# Altium schematic sheet Sheet_FS872.schdoc
size 197 x 98 mm
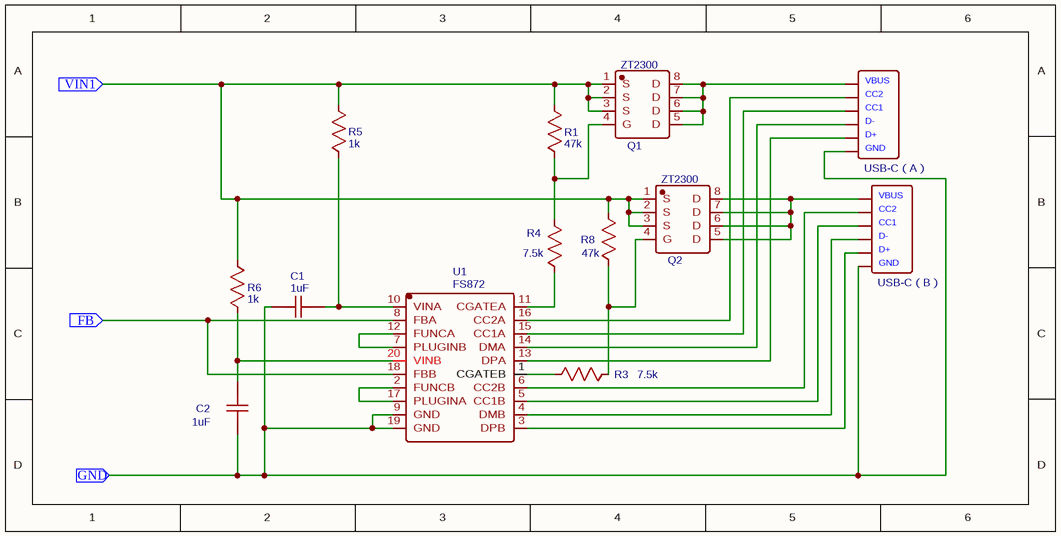
[diagram p0: Sheet_FS872.schdoc]

## Parts
C1  1uF  [C0603]
C2  1uF  [C0603]
Q1  ZT2300  [DFN3X3-8L]
Q2  ZT2300  [DFN3X3-8L]
R1  47k  [R0603]
R3  7.5k  [R0603]
R4  7.5k  [R0603]
R5  1k  [R1206]
R6  1k  [R1206]
R8  47k  [R0603]
U1  FS872  [ETSSOP20_L6.5-W4.4-P0.65-LS6.4-BL]
U2  USB-C（B）  [FCQFN-15L_L3.0-W3.0-P0.50-BL_SCT63140FMAR]
U3  USB-C（A）  [FCQFN-15L_L3.0-W3.0-P0.50-BL_SCT63140FMAR]

## Ports
FB (in), GND (in), VIN1 (in)

## Nets
FB: U1.8(FBA) U1.18(FBB) ; port FB
GND: C1.1 C2.1 U1.9(GND) U1.19(GND) ; port GND
VIN1: Q1.1(S) Q1.2(S) Q1.3(S) Q2.1(S) Q2.2(S) Q2.3(S) R1.2 R5.2 R6.2 R8.2 ; port VIN1
NetC1_2: C1.2 R5.1 U1.10(VINA)
NetC2_2: C2.2 R6.1 U1.20(VINB)
NetQ1_4: Q1.4(G) R1.1 R4.2
NetQ1_5: Q1.5(D) Q1.6(D) Q1.7(D) Q1.8(D)
NetQ2_4: Q2.4(G) R3.2 R8.1
NetQ2_5: Q2.5(D) Q2.6(D) Q2.7(D) Q2.8(D)
NetR3_1: R3.1 U1.1(CGATEB)
NetR4_1: R4.1 U1.11(CGATEA)
NetU1_2: U1.2(FUNCB) U1.17(PLUGINA)
NetU1_7: U1.7(PLUGINB) U1.12(FUNCA)

Not connected (* = marked no-connect by the designer): U1 3(DPB) 4(DMB) 5(CC1B) 6(CC2B) 13(DPA) 14(DMA) 15(CC1A) 16(CC2A); U2 2(SHELD) 3(SHELD) 4(SHELD) 5(SHELD) 6(SHELD); U3 2(SHELD) 3(SHELD) 4(SHELD) 5(SHELD) 6(SHELD)

## Notes on the sheet
- (in symbol USB-C（A）) VBUS; CC2; CC1; D-; D+; GND
- (in symbol USB-C（B）) VBUS; CC2; CC1; D-; D+; GND

## Library data of the parts
C1 C2 = 0.1u: nameAlias: Value(F); Contributor: LCEDA_Lib; Package Display: No; spicePre: C; spiceSymbolName: C_0603_US
Q1 Q2 = ZT2300: Manufacturer: VBsemi Elec; Manufacturer Part: NCE3035G; Contributor: LCSC; Supplier: LCSC; Supplier Part: C710023; spicePre: Q; spiceSymbolName: NCE3035G
R1 R8 = 47k: nameAlias: Value(Ω); Contributor: LCEDA_Lib; Package Display: No; spicePre: R; spiceSymbolName: R_0603_US
R3 R4 = 7.5k: nameAlias: Value(Ω); Contributor: LCEDA_Lib; Package Display: No; spicePre: R; spiceSymbolName: R_0603_US
R5 R6 = 1k: nameAlias: Value(Ω); Contributor: LCEDA_Lib; Package Display: No; spicePre: R; spiceSymbolName: R_1206_US
U1 = FS8626: Manufacturer: TI(德州仪器); Manufacturer Part: PCF8574APWR; Contributor: LCSC; Package Display: No; Supplier: LCSC; Supplier Part: C94361; JLCPCB Part Class: Extended Part; spicePre: U; spiceSymbolName: PCF8574APWR
U2 = USB-C（B）: Manufacturer: SCT; Manufacturer Part: SCT63140FMAR; Contributor: TaoPatrick; SMT Type: Extend; Supplier Part: C509059; JLCPCB SMD: Yes; spicePre: U; spiceSymbolName: USB-C
U3 = USB-C（A）: Manufacturer: SCT; Manufacturer Part: SCT63140FMAR; Contributor: TaoPatrick; SMT Type: Extend; Supplier Part: C509059; JLCPCB SMD: Yes; spicePre: U; spiceSymbolName: USB-C